# Altium schematic sheet S7CAS-PLEIADES-CARTE-MERE_P07_DAC.SchDoc
size Tabloid; DocumentNumber: 16; SheetNumber: 16; SheetTotal: 16; Sheet_Name: DAC; Size: 11x17
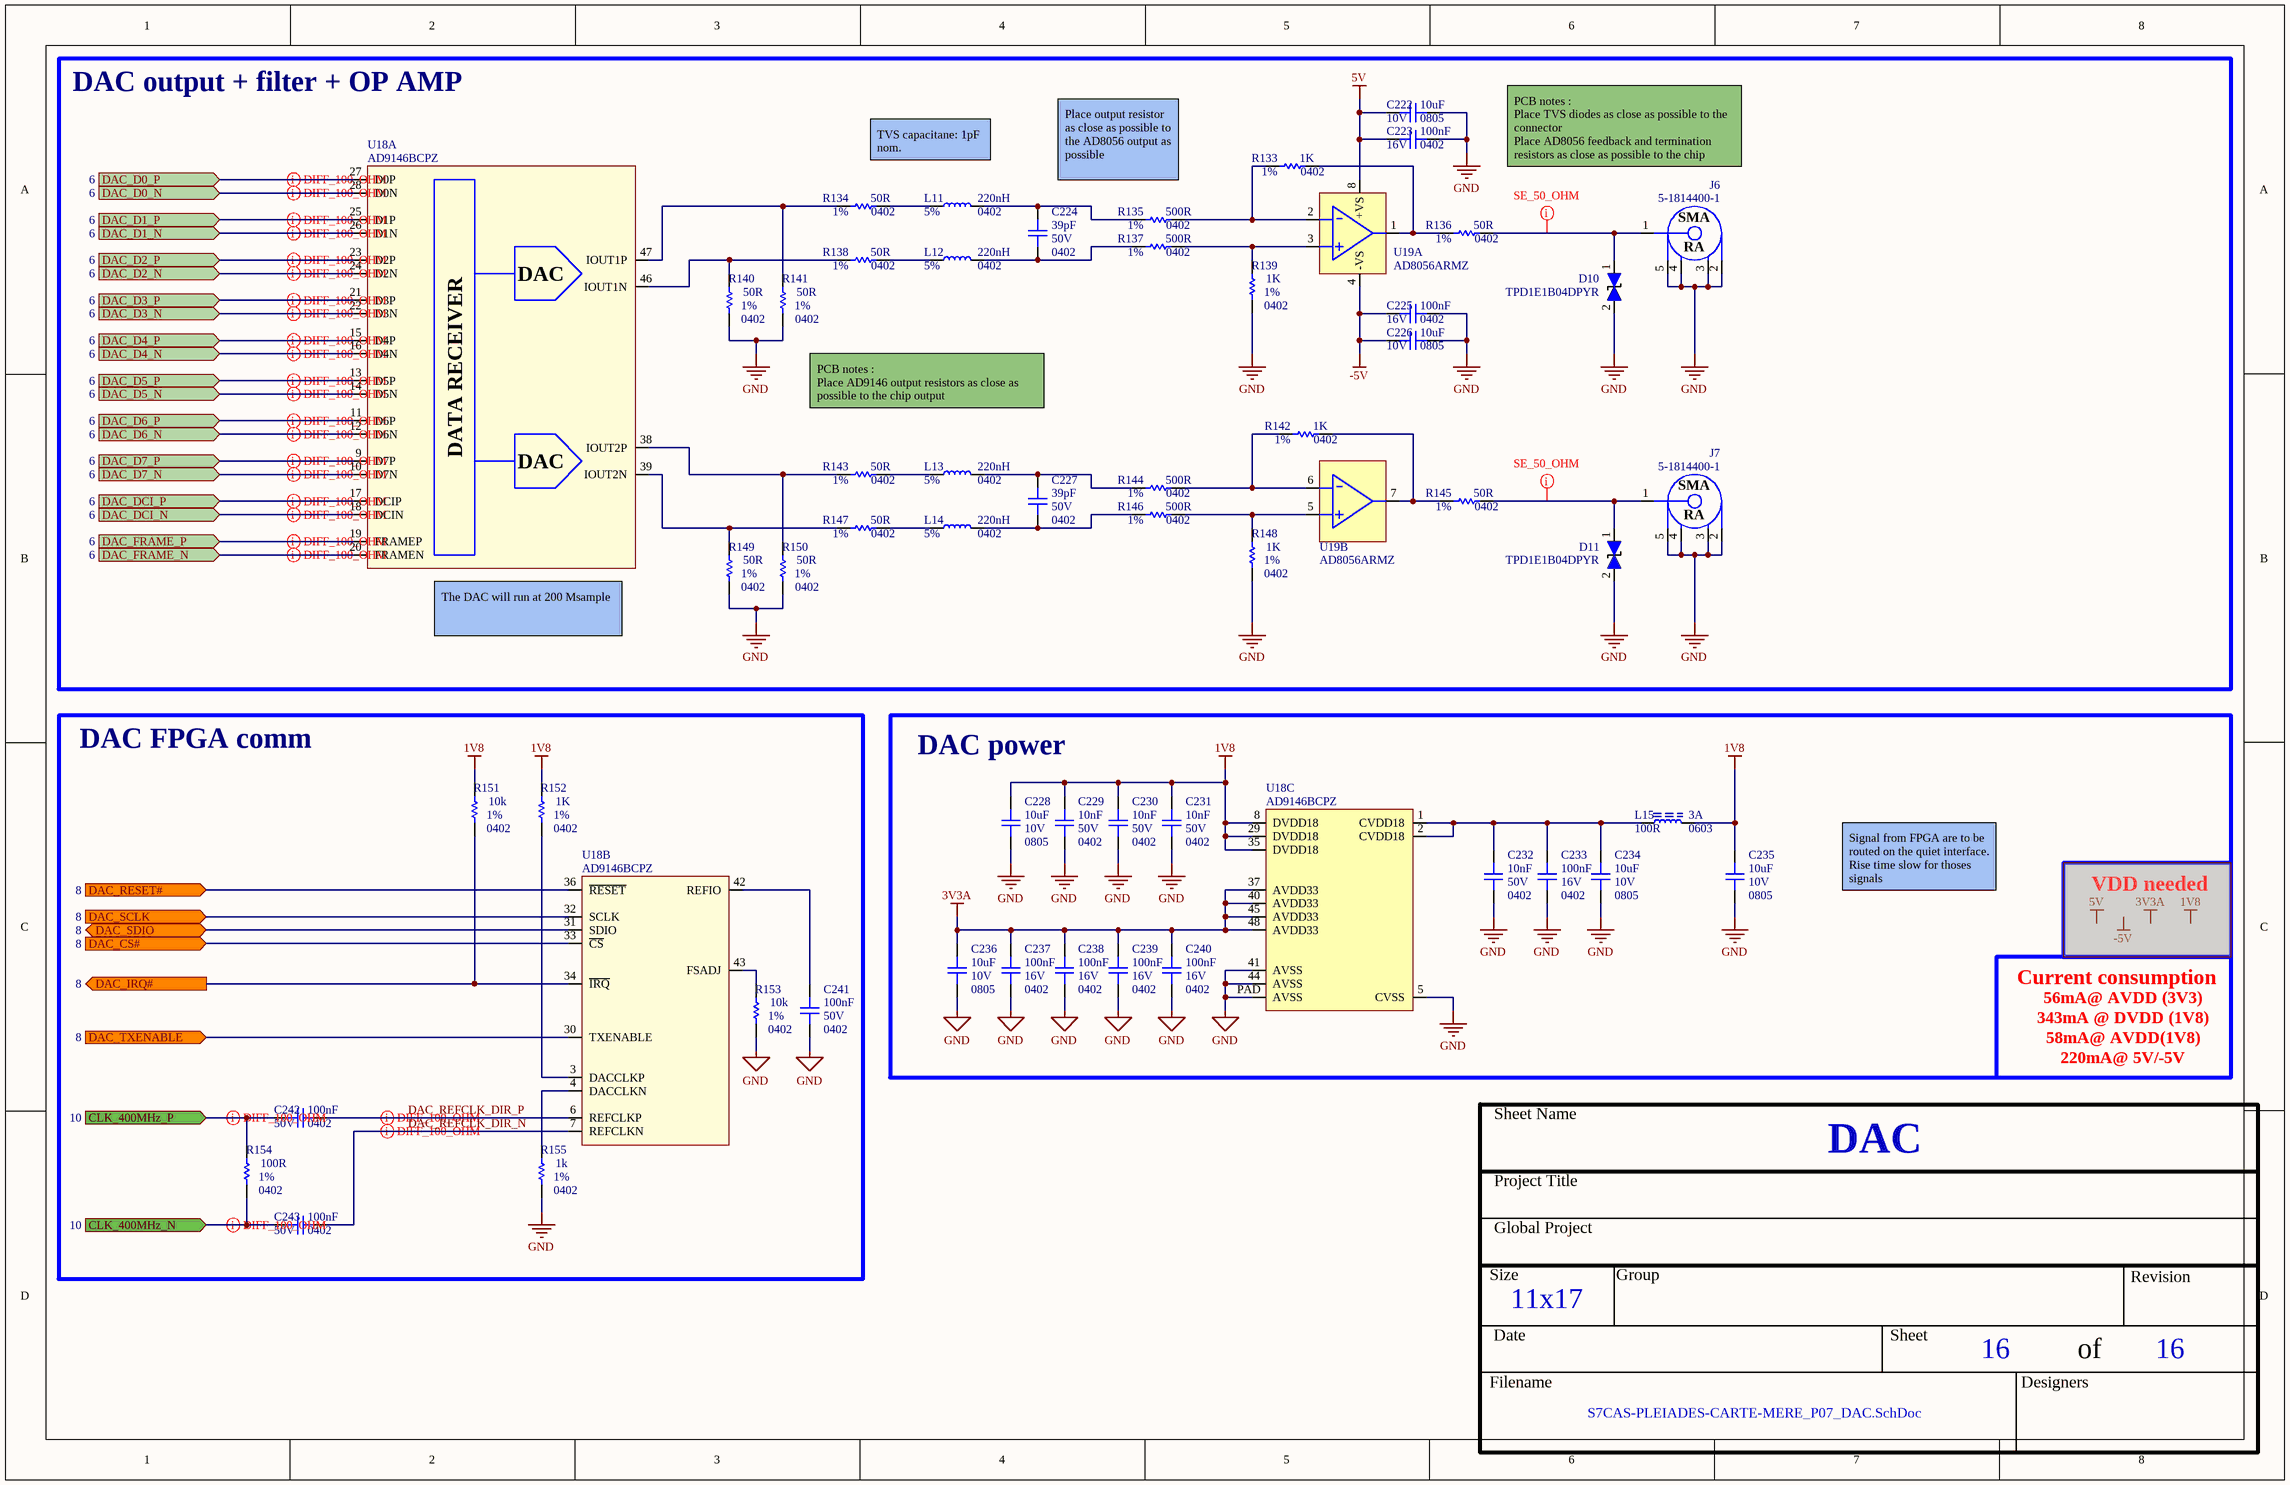
[diagram p0: S7CAS-PLEIADES-CARTE-MERE_P07_DAC.SchDoc]

## Parts
C222  value 10uF  Voltage: 10V  Package: 0805  [CAP_0805]  (hidden comment: CAP - 0805)
C223  value 100nF  Voltage: 16V  Package: 0402  [CAP_0402]  (hidden comment: CAP - 0402)
C224  value 39pF  Voltage: 50V  Package: 0402  [CAP_0402]  (hidden comment: CAP - 0402)
C225  value 100nF  Voltage: 16V  Package: 0402  [CAP_0402]  (hidden comment: CAP - 0402)
C226  value 10uF  Voltage: 10V  Package: 0805  [CAP_0805]  (hidden comment: CAP - 0805)
C227  value 39pF  Voltage: 50V  Package: 0402  [CAP_0402]  (hidden comment: CAP - 0402)
C228  value 10uF  Voltage: 10V  Package: 0805  [CAP_0805]  (hidden comment: CAP - 0805)
C229  value 10nF  Voltage: 50V  Package: 0402  [CAP_0402]  (hidden comment: CAP - 0402)
C230  value 10nF  Voltage: 50V  Package: 0402  [CAP_0402]  (hidden comment: CAP - 0402)
C231  value 10nF  Voltage: 50V  Package: 0402  [CAP_0402]  (hidden comment: CAP - 0402)
C232  value 10nF  Voltage: 50V  Package: 0402  [CAP_0402]  (hidden comment: CAP - 0402)
C233  value 100nF  Voltage: 16V  Package: 0402  [CAP_0402]  (hidden comment: CAP - 0402)
C234  value 10uF  Voltage: 10V  Package: 0805  [CAP_0805]  (hidden comment: CAP - 0805)
C235  value 10uF  Voltage: 10V  Package: 0805  [CAP_0805]  (hidden comment: CAP - 0805)
C236  value 10uF  Voltage: 10V  Package: 0805  [CAP_0805]  (hidden comment: CAP - 0805)
C237  value 100nF  Voltage: 16V  Package: 0402  [CAP_0402]  (hidden comment: CAP - 0402)
C238  value 100nF  Voltage: 16V  Package: 0402  [CAP_0402]  (hidden comment: CAP - 0402)
C239  value 100nF  Voltage: 16V  Package: 0402  [CAP_0402]  (hidden comment: CAP - 0402)
C240  value 100nF  Voltage: 16V  Package: 0402  [CAP_0402]  (hidden comment: CAP - 0402)
C241  value 100nF  Voltage: 50V  Package: 0402  [CAP_0402]  (hidden comment: CAP - 0402)
C242  value 100nF  Voltage: 50V  Package: 0402  [CAP_0402]  (hidden comment: CAP - 0402)
C243  value 100nF  Voltage: 50V  Package: 0402  [CAP_0402]  (hidden comment: CAP - 0402)
D10  TPD1E1B04DPYR  [TVS_DATA_TPD1E1B04DPYR]
D11  TPD1E1B04DPYR  [TVS_DATA_TPD1E1B04DPYR]
J6  5-1814400-1  [CONN_SMA_5-1814400-1]
J7  5-1814400-1  [CONN_SMA_5-1814400-1]
L11  value 220nH  Precision: 5%  Package: 0402  [IND_0402]  (hidden comment: IND_0402)
L12  value 220nH  Precision: 5%  Package: 0402  [IND_0402]  (hidden comment: IND_0402)
L13  value 220nH  Precision: 5%  Package: 0402  [IND_0402]  (hidden comment: IND_0402)
L14  value 220nH  Precision: 5%  Package: 0402  [IND_0402]  (hidden comment: IND_0402)
L15  value 100R  Current: 3A  Package: 0603  [FER_0603]  (hidden comment: FER - 0603)
R133  value 1K  Package: 0402  Precision: 1%  [RES_0402]  (hidden comment: RES - 0402)
R134  value 50R  Package: 0402  Precision: 1%  [RES_0402]  (hidden comment: RES - 0402)
R135  value 500R  Package: 0402  Precision: 1%  [RES_0402]  (hidden comment: RES - 0402)
R136  value 50R  Package: 0402  Precision: 1%  [RES_0402]  (hidden comment: RES - 0402)
R137  value 500R  Package: 0402  Precision: 1%  [RES_0402]  (hidden comment: RES - 0402)
R138  value 50R  Package: 0402  Precision: 1%  [RES_0402]  (hidden comment: RES - 0402)
R139  value 1K  Package: 0402  Precision: 1%  [RES_0402]  (hidden comment: RES - 0402)
R140  value 50R  Package: 0402  Precision: 1%  [RES_0402]  (hidden comment: RES - 0402)
R141  value 50R  Package: 0402  Precision: 1%  [RES_0402]  (hidden comment: RES - 0402)
R142  value 1K  Package: 0402  Precision: 1%  [RES_0402]  (hidden comment: RES - 0402)
R143  value 50R  Package: 0402  Precision: 1%  [RES_0402]  (hidden comment: RES - 0402)
R144  value 500R  Package: 0402  Precision: 1%  [RES_0402]  (hidden comment: RES - 0402)
R145  value 50R  Package: 0402  Precision: 1%  [RES_0402]  (hidden comment: RES - 0402)
R146  value 500R  Package: 0402  Precision: 1%  [RES_0402]  (hidden comment: RES - 0402)
R147  value 50R  Package: 0402  Precision: 1%  [RES_0402]  (hidden comment: RES - 0402)
R148  value 1K  Package: 0402  Precision: 1%  [RES_0402]  (hidden comment: RES - 0402)
R149  value 50R  Package: 0402  Precision: 1%  [RES_0402]  (hidden comment: RES - 0402)
R150  value 50R  Package: 0402  Precision: 1%  [RES_0402]  (hidden comment: RES - 0402)
R151  value 10k  Package: 0402  Precision: 1%  [RES_0402]  (hidden comment: RES - 0402)
R152  value 1K  Package: 0402  Precision: 1%  [RES_0402]  (hidden comment: RES - 0402)
R153  value 10k  Package: 0402  Precision: 1%  [RES_0402]  (hidden comment: RES - 0402)
R154  value 100R  Package: 0402  Precision: 1%  [RES_0402]  (hidden comment: RES - 0402)
R155  value 1k  Package: 0402  Precision: 1%  [RES_0402]  (hidden comment: RES - 0402)
U18  AD9146BCPZ  [DAC_AD9146BCPZ]  (parts A,B,C of 3)
U19  AD8056ARMZ  [OPAMP_AD8056ARMZ]  (parts A,B of 2)

## Blocks framed on the sheet
DAC output + filter + OP AMP: C222-C227 D10 D11 J6 J7 L11-L14 R133-R150 U18 U19
DAC FPGA comm: C241-C243 R151-R155 U18
DAC power: C228-C240 L15 U18

## Ports
CLK_400MHz_N (in, see 10), CLK_400MHz_P (in, see 10), DAC_CS# (in, see 8), DAC_D0_N (in, see 6), DAC_D0_P (in, see 6), DAC_D1_N (in, see 6), DAC_D1_P (in, see 6), DAC_D2_N (in, see 6), DAC_D2_P (in, see 6), DAC_D3_N (in, see 6), DAC_D3_P (in, see 6), DAC_D4_N (in, see 6), DAC_D4_P (in, see 6), DAC_D5_N (in, see 6), DAC_D5_P (in, see 6), DAC_D6_N (in, see 6), DAC_D6_P (in, see 6), DAC_D7_N (in, see 6), DAC_D7_P (in, see 6), DAC_DCI_N (in, see 6), DAC_DCI_P (in, see 6), DAC_FRAME_N (in, see 6), DAC_FRAME_P (in, see 6), DAC_IRQ# (out, see 8), DAC_RESET# (in, see 8), DAC_SCLK (in, see 8), DAC_SDIO (bidir, see 8), DAC_TXENABLE (in, see 8)

## Nets
1V8: C228.2 C229.2 C230.2 C231.2 C235.2 L15.1 R151.2 R152.2 U18.8(DVDD18) U18.29(DVDD18) U18.35(DVDD18)
3V3A: C236.2 C237.2 C238.2 C239.2 C240.2 U18.37(AVDD33) U18.40(AVDD33) U18.45(AVDD33) U18.48(AVDD33)
5V: C222.2 C223.2 U19.8(+VS)
-5V: C225.2 C226.2 U19.4(-VS)
GND: C222.1 C223.1 C225.1 C226.1 C228.1 C229.1 C230.1 C231.1 C232.1 C233.1 C234.1 C235.1 C236.1 C237.1 C238.1 C239.1 C240.1 C241.1 D10.2(i/o) D11.2(i/o) J6.2 J6.3 J6.4 J6.5 J7.2 J7.3 J7.4 J7.5 R139.1 R140.1 R141.1 R148.1 R149.1 R150.1 R153.1 R155.1 U18.5(CVSS) U18.41(AVSS) U18.44(AVSS) U18.PAD(AVSS)
CLK_400MHz_N: C243.2 R154.1 ; port CLK_400MHz_N
CLK_400MHz_P: C242.2 R154.2 ; port CLK_400MHz_P
DAC_CS#: U18.33(~{CS}) ; port DAC_CS#
DAC_D0_N: U18.28(D0N) ; port DAC_D0_N
DAC_D0_P: U18.27(D0P) ; port DAC_D0_P
DAC_D1_N: U18.26(D1N) ; port DAC_D1_N
DAC_D1_P: U18.25(D1P) ; port DAC_D1_P
DAC_D2_N: U18.24(D2N) ; port DAC_D2_N
DAC_D2_P: U18.23(D2P) ; port DAC_D2_P
DAC_D3_N: U18.22(D3N) ; port DAC_D3_N
DAC_D3_P: U18.21(D3P) ; port DAC_D3_P
DAC_D4_N: U18.16(D4N) ; port DAC_D4_N
DAC_D4_P: U18.15(D4P) ; port DAC_D4_P
DAC_D5_N: U18.14(D5N) ; port DAC_D5_N
DAC_D5_P: U18.13(D5P) ; port DAC_D5_P
DAC_D6_N: U18.12(D6N) ; port DAC_D6_N
DAC_D6_P: U18.11(D6P) ; port DAC_D6_P
DAC_D7_N: U18.10(D7N) ; port DAC_D7_N
DAC_D7_P: U18.9(D7P) ; port DAC_D7_P
DAC_DCI_N: U18.18(DCIN) ; port DAC_DCI_N
DAC_DCI_P: U18.17(DCIP) ; port DAC_DCI_P
DAC_FRAME_N: U18.20(FRAMEN) ; port DAC_FRAME_N
DAC_FRAME_P: U18.19(FRAMEP) ; port DAC_FRAME_P
DAC_IRQ#: R151.1 U18.34(~{IRQ}) ; port DAC_IRQ#
DAC_REFCLK_DIR_N: C243.1 U18.7(REFCLKN)
DAC_REFCLK_DIR_P: C242.1 U18.6(REFCLKP)
DAC_RESET#: U18.36(~{RESET}) ; port DAC_RESET#
DAC_SCLK: U18.32(SCLK) ; port DAC_SCLK
DAC_SDIO: U18.31(SDIO) ; port DAC_SDIO
DAC_TXENABLE: U18.30(TXENABLE) ; port DAC_TXENABLE
NetC224_1: C224.1 L12.1 R137.2
NetC224_2: C224.2 L11.1 R135.2
NetC227_1: C227.1 L14.1 R146.2
NetC227_2: C227.2 L13.1 R144.2
NetC232_2: C232.2 C233.2 C234.2 L15.2 U18.1(CVDD18) U18.2(CVDD18)
NetC241_2: C241.2 U18.42(REFIO)
NetD10_1: D10.1(i/o) J6.1 R136.1
NetD11_1: D11.1(i/o) J7.1 R145.1
NetL11_2: L11.2 R134.1
NetL12_2: L12.2 R138.1
NetL13_2: L13.2 R143.1
NetL14_2: L14.2 R147.1
NetR133_1: R133.1 R136.2 U19.1(OUT1)
NetR133_2: R133.2 R135.1 U19.2(-IN1)
NetR134_2: R134.2 R141.2 U18.47(IOUT1P)
NetR137_1: R137.1 R139.2 U19.3(+IN1)
NetR138_2: R138.2 R140.2 U18.46(IOUT1N)
NetR142_1: R142.1 R145.2 U19.7(OUT2)
NetR142_2: R142.2 R144.1 U19.6(-IN2)
NetR143_2: R143.2 R150.2 U18.38(IOUT2P)
NetR146_1: R146.1 R148.2 U19.5(+IN2)
NetR147_2: R147.2 R149.2 U18.39(IOUT2N)
NetR152_1: R152.1 U18.3(DACCLKP)
NetR153_2: R153.2 U18.43(FSADJ)
NetR155_2: R155.2 U18.4(DACCLKN)

## Layout directives
differential pair; differential pair class DIFF_100_OHM: DAC_D0_N, DAC_D0_P, DAC_D1_N, DAC_D1_P, DAC_D2_N, DAC_D2_P, DAC_D3_N, DAC_D3_P, DAC_D4_N, DAC_D4_P, DAC_D5_N, DAC_D5_P, DAC_D6_N, DAC_D6_P, DAC_D7_N, DAC_D7_P, DAC_DCI_N, DAC_DCI_P, DAC_FRAME_N, DAC_FRAME_P
mark named SE_50_OHM: NetD10_1, NetD11_1
differential pair; net class DIFF_100_OHM: CLK_400MHz_N, CLK_400MHz_P, DAC_REFCLK_DIR_N, DAC_REFCLK_DIR_P

## Notes on the sheet
- TVS capacitane: 1pF nom.
- PCB notes :
  Place TVS diodes as close as possible to the connector
  Place AD8056 feedback and termination resistors as close as possible to the chip
- Place output resistor as close as possible to the AD8056 output as possible
- PCB notes :
  Place AD9146 output resistors as close as possible to the chip output
- (near U18) The DAC will run at 200 Msample
- Signal from FPGA are to be routed on the quiet interface. Rise time slow for thoses signals
- VDD needed
- Current consumption
- 56mA@ AVDD (3V3)
- 343mA @ DVDD (1V8)
- 58mA@ AVDD(1V8)
- 220mA@ 5V/-5V
- Sheet Name
- Project Title
- Global Project
- Size
- Group
- Revision
- Date
- Sheet
- of
- Filename
- Designers
- (in symbol CONN_SMA_5-1814400-1) SMA; RA
- (in symbol DAC_AD9146BCPZ, part A) DAC; DATA RECEIVER

## Library data of the parts
C222 C226 C228 C234-C236 = CAP - 0805: Mfg: CL21B106KPQNNNE; Precision: 10%; Current: *; CreatedBy: Jonathan Bouchard; Power: *
C223 C225 C233 C237-C240 = CAP - 0402: Mfg Part Number: CL05B104KO5NNNC; Precision: 10%; Current: *; CreatedBy: Jonathan Bouchard; Power: *
C224 C227 C241-C243 = CAP - 0402: Precision: 10%; Current: *; CreatedBy: Jonathan Bouchard; Power: *
C229-C232 = CAP - 0402: Mfg Part Number: CL05B103KB5NNNC; Precision: 10%; Current: *; CreatedBy: Jonathan Bouchard; Temperature: X7R; Power: *
D10 D11 = TVS_DATA_TPD1E1B04DPYR: TVS - TVS DIODE 3.6V 8.5V - 0402; Manufacturer #1: Texas Instruments; Current Rating: 6.3Apeak; Power Max: 50Wpeak; GRAMS Lib Spec: 2.8; Magnetic Material: Unknown; Polarized: No; Value: *; Tolerance: *; Voltage Rating: 3.6V; HelpURL: http://www.ti.com/lit/ds/symlink/tpd1e1b04.pdf; CreatedBy/Date: Keven Deslandes - 2018/10/19; VerifiedBy: Caroline Paulin - 28 janv 2019; Temperature: -40°C ~ 125°C (TA); Package: 0402; Manufacturer #2: *; Note: *; Assembly Type: SMD; Part Number #2: *; Part Number #1: TPD1E1B04DPYR; Supplier 1: Digi-Key; Supplier Part Number 1: 296-47364-1-ND; Cryo: UNKNOWN
J6 J7 = CONN_SMA_5-1814400-1: CONN -  SMA JACK R/A 50 OHM - TH; Mfg: TE Connectivity AMP Connectors; Voltage: *; Current: *; Power: *; Mfg Part Number: 5-1814400-1; HelpURL: http://www.te.com/commerce/DocumentDelivery/DDEController?Action=srchrtrv&DocNm=1814400&DocType=Customer+Drawing&DocLang=English; CreatedBy: Jonathan Bouchard; Temperature: -55°C ~ 85°C; Value: *; Precision: *; Package: TH-5; Supplier 1: Digikey; Supplier Part Number 1: A97593-ND
R133-R155 = RES - 0402: Voltage: 50V; Power: 1/16W; Current: *; CreatedBy: Jonathan Bouchard
U18 = DAC_AD9146BCPZ: DAC - 16BIT SRL HIGH SPEED - QFN-48; Voltage: 3.13 V ~ 3.47 V / 1.71 V ~ 1.89 V; Mfg: Analog Devices Inc.; Current: *; Power: *; Mfg Part Number: AD9146BCPZ; HelpURL: http://www.analog.com/media/en/technical-documentation/data-sheets/AD9146.PDF; CreatedBy: Jonathan Bouchard; Temperature: -40°C ~ 85°C; Value: *; Precision: 16 Bit; Package: QFN-48; Supplier 1: Digikey; Supplier Part Number 1: AD9146BCPZ-ND
U19 = OPAMP_AD8056ARMZ: OPAMP - VFB 300MHZ - 8MSOP; Voltage: 8 V ~ 12 V, ±4 V ~ 6 V; Current: 60mA; Mfg: Analog Devices; Power: *; Mfg Part Number: AD8056ARMZ; HelpURL: http://www.analog.com/media/en/technical-documentation/data-sheets/AD8055_8056.pdf; CreatedBy: Jonathan Bouchard; Temperature: -40°C ~ 125°C; Value: *; Precision: *; Package: MSOP-8; Supplier 1: Digikey; Supplier Part Number 1: AD8056ARMZ-REEL7CT-ND
L11-L14 = IND_0402: Voltage: *; CreatedBy: Jonathan Bouchard; Power: *; NI: *; Current: *
L15 = FER - 0603: Voltage: *; CreatedBy: Jonathan Bouchard; Power: *; Precision: *